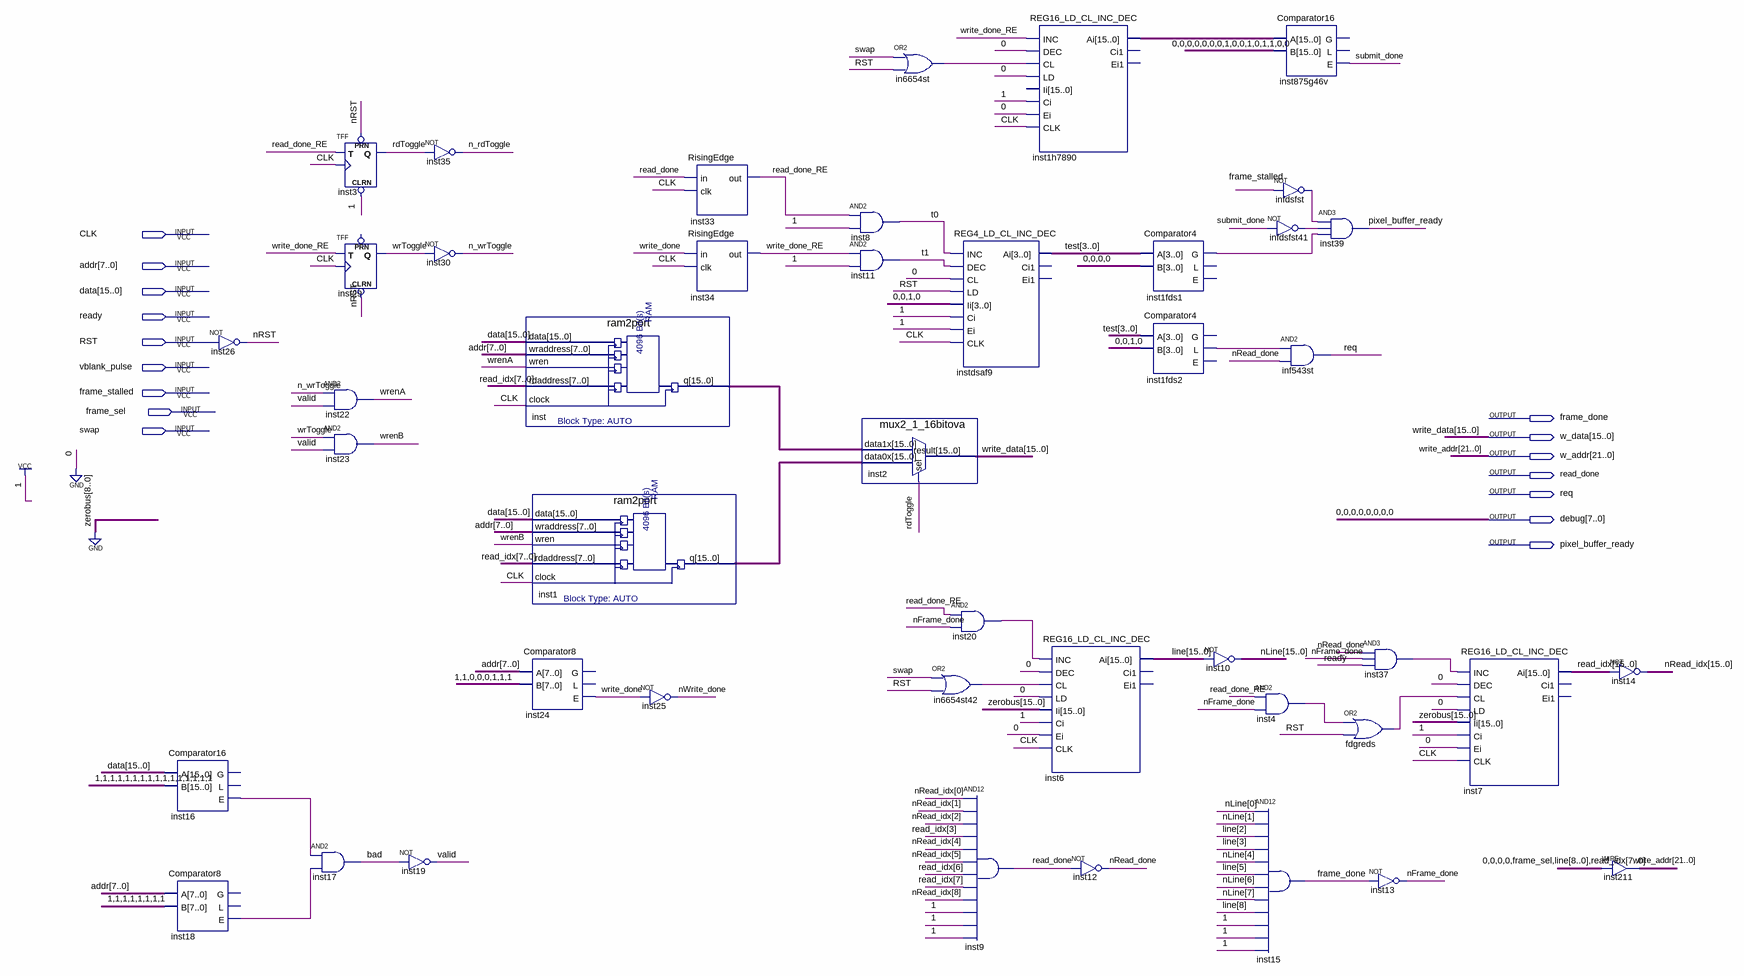
[diagram p0: schematic sheet]
// Quartus schematic writer_DMA.bdf as structural Verilog: 44 symbols, 16 pins
module writer_DMA (
  input  CLK,
  input  [7:0] addr,
  input  [15:0] data,
  input  ready,
  input  RST,
  input  vblank_pulse,
  input  frame_stalled,
  input  frame_sel,
  input  swap,
  output frame_done,
  output [15:0] w_data,
  output [21:0] w_addr,
  output read_done,
  output req,
  output [7:0] debug,
  output pixel_buffer_ready
);

  wire bad, fdgreds_out, in6654st42_out, in6654st_out, infdsfst41_out, infdsfst_out, inst1fds1_g,
       inst1fds2_l, inst4_out, inst16_e, inst18_e, inst20_out, inst37_out, n_rdToggle, n_wrToggle,
       nFrame_done, nRead_done, nRST, nWrite_done, rdToggle, read_done_RE, submit_done, t0, t1, valid, wrenA,
       wrenB, write_done, write_done_RE, wrToggle;
  wire [3:0] test;
  wire [15:0] inst1_q, inst1h7890_ai, inst_q, line, nLine, nRead_idx, read_idx;
  wire [15:9] zerobus;

  Comparator16 inst16 (.A(data), .B({16{1'b1}}), .E(inst16_e));  // open: G, L
  Comparator8 inst18 (.A(addr), .B({8{1'b1}}), .E(inst18_e));  // open: G, L
  not inst26 (nRST, RST);
  TFF inst3 (.PRN(nRST), .CLRN(1'b1), .T(read_done_RE), .CLK(CLK), .Q(rdToggle));
  TFF inst29 (.CLRN(nRST), .T(write_done_RE), .CLK(CLK), .Q(wrToggle));  // open: PRN
  and inst22 (wrenA, n_wrToggle, valid);
  and inst23 (wrenB, wrToggle, valid);
  and inst17 (bad, inst16_e, inst18_e);
  not inst35 (n_rdToggle, rdToggle);
  not inst30 (n_wrToggle, wrToggle);
  not inst19 (valid, bad);
  ram2port inst (.data(data), .wraddress(addr), .wren(wrenA), .rdaddress(read_idx[7:0]), .clock(CLK), .q(inst_q));
  ram2port inst1 (.data(data), .wraddress(addr), .wren(wrenB), .rdaddress(read_idx[7:0]), .clock(CLK), .q(inst1_q));
  Comparator8 inst24 (.A(addr), .B(8'b11000111), .E(write_done));  // open: G, L
  not inst25 (nWrite_done, write_done);
  RisingEdge inst33 (.in(read_done), .clk(CLK), .out(read_done_RE));
  RisingEdge inst34 (.in(write_done), .clk(CLK), .out(write_done_RE));
  and inst8 (t0, read_done_RE, 1'b1);
  and inst11 (t1, write_done_RE, 1'b1);
  or in6654st (in6654st_out, swap, RST);
  mux2_1_16bitova inst2 (.data1x(inst_q), .data0x(inst1_q), .sel(rdToggle), .result(w_data));
  REG4_LD_CL_INC_DEC instdsaf9 (
    .INC(t0), .DEC(t1), .CL(1'b0), .LD(RST), .Ii(4'b0010), .Ci(1'b1), .Ei(1'b1), .CLK(CLK), .Ai(test));  // open: Ci1, Ei1
  and inst20 (inst20_out, read_done_RE, nFrame_done);
  or in6654st42 (in6654st42_out, swap, RST);
  and inst9 (read_done, nRead_idx[0], nRead_idx[1], nRead_idx[2], read_idx[3], nRead_idx[4], nRead_idx[5], read_idx[6], read_idx[7], nRead_idx[8], 1'b1, 1'b1, 1'b1);
  REG16_LD_CL_INC_DEC inst1h7890 (
    .INC(write_done_RE), .DEC(1'b0), .CL(in6654st_out), .LD(1'b0), .Ci(1'b1), .Ei(1'b0), .CLK(CLK),
    .Ai(inst1h7890_ai));  // open: Ii, Ci1, Ei1
  REG16_LD_CL_INC_DEC inst6 (
    .INC(inst20_out), .DEC(1'b0), .CL(in6654st42_out), .LD(1'b0), .Ii({zerobus, {9{1'b0}}}), .Ci(1'b1),
    .Ei(1'b0), .CLK(CLK), .Ai(line));  // open: Ci1, Ei1
  not inst12 (nRead_done, read_done);
  Comparator4 inst1fds1 (.A(test), .B(4'b0000), .G(inst1fds1_g));  // open: L, E
  Comparator4 inst1fds2 (.A(test), .B(4'b0010), .L(inst1fds2_l));  // open: G, E
  assign nLine = ~line;  // NOT inst10, 16 bits wide
  and inst4 (inst4_out, read_done_RE, nFrame_done);
  and inst15 (frame_done, nLine[0], nLine[1], line[2], line[3], nLine[4], line[5], nLine[6], nLine[7], line[8], 1'b1, 1'b1, 1'b1);
  Comparator16 inst875g46v (.A(inst1h7890_ai), .B(16'b0000000100101100), .E(submit_done));  // open: G, L
  not infdsfst (infdsfst_out, frame_stalled);
  not infdsfst41 (infdsfst41_out, submit_done);
  and inf543st (req, inst1fds2_l, nRead_done);
  and inst39 (pixel_buffer_ready, infdsfst_out, infdsfst41_out, inst1fds1_g);
  or fdgreds (fdgreds_out, inst4_out, RST);
  and inst37 (inst37_out, nRead_done, nFrame_done, ready);
  not inst13 (nFrame_done, frame_done);
  REG16_LD_CL_INC_DEC inst7 (
    .INC(inst37_out), .DEC(1'b0), .CL(fdgreds_out), .LD(1'b0), .Ii({zerobus, {9{1'b0}}}), .Ci(1'b1),
    .Ei(1'b0), .CLK(CLK), .Ai(read_idx));  // open: Ci1, Ei1
  assign nRead_idx = ~read_idx;  // NOT inst14, 16 bits wide
  assign w_addr = {4'b0000, frame_sel, line[8:0], read_idx[7:0]};  // WIRE inst211

  assign debug = {8{1'b0}};

  // Other names for the same wires on the sheet: write_addr[21:0] = w_addr; write_data[15:0] = w_data
endmodule
